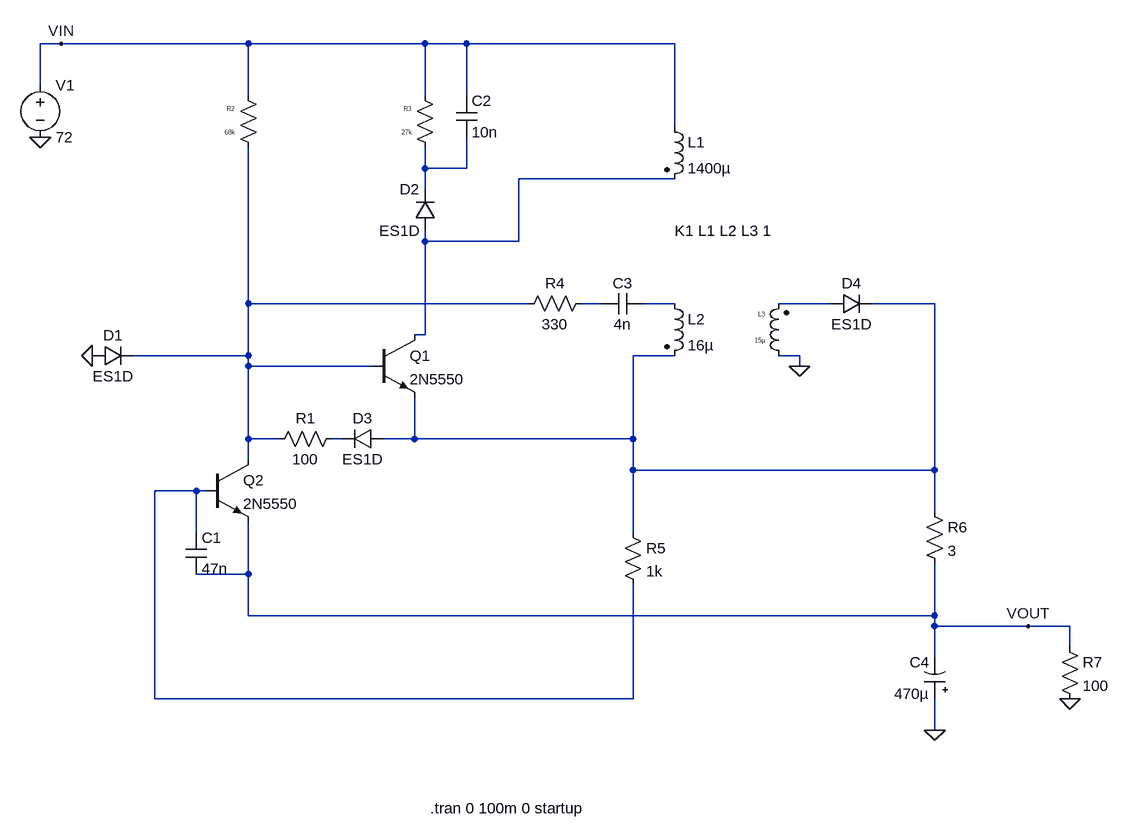
[diagram p0: schematic Motor Controller Power Supply.asc]
Motor Controller Power Supply.asc, the LTspice schematic file:
Version 4
SHEET 1 1496 968
WIRE -96 -224 -128 -224
WIRE 192 -224 -96 -224
WIRE 464 -224 192 -224
WIRE 528 -224 464 -224
WIRE 848 -224 528 -224
WIRE -128 -160 -128 -224
WIRE 192 -144 192 -224
WIRE 464 -144 464 -224
WIRE 528 -144 528 -224
WIRE 848 -96 848 -224
WIRE 464 -32 464 -64
WIRE 528 -32 528 -80
WIRE 528 -32 464 -32
WIRE 848 -16 608 -16
WIRE 464 0 464 -32
WIRE 464 80 464 64
WIRE 608 80 608 -16
WIRE 608 80 464 80
WIRE 192 176 192 -64
WIRE 624 176 192 176
WIRE 736 176 704 176
WIRE 848 176 800 176
WIRE 1088 176 1008 176
WIRE 1248 176 1152 176
WIRE 464 224 464 80
WIRE 464 224 448 224
WIRE 192 256 192 176
WIRE 192 256 16 256
WIRE 848 256 784 256
WIRE 1040 256 1008 256
WIRE 192 272 192 256
WIRE 384 272 192 272
WIRE 1040 272 1040 256
WIRE 192 384 192 272
WIRE 240 384 192 384
WIRE 336 384 320 384
WIRE 448 384 448 320
WIRE 448 384 400 384
WIRE 784 384 784 256
WIRE 784 384 448 384
WIRE 192 416 192 384
WIRE 784 432 784 384
WIRE 1248 432 1248 176
WIRE 1248 432 784 432
WIRE 112 464 48 464
WIRE 128 464 112 464
WIRE 1248 496 1248 432
WIRE 112 528 112 464
WIRE 784 528 784 432
WIRE 192 592 192 512
WIRE 192 592 112 592
WIRE 192 656 192 592
WIRE 1248 656 1248 576
WIRE 1248 656 192 656
WIRE 1248 672 1248 656
WIRE 1392 672 1248 672
WIRE 1456 672 1392 672
WIRE 1456 704 1456 672
WIRE 1248 720 1248 672
WIRE 48 784 48 464
WIRE 784 784 784 608
WIRE 784 784 48 784
WIRE 1248 832 1248 784
FLAG 1040 272 0
FLAG 1248 832 0
FLAG -96 -224 VIN
FLAG -48 256 0
FLAG -128 -80 0
FLAG 1456 784 0
FLAG 1392 672 VOUT
SYMBOL npn 384 224 R0
SYMATTR InstName Q1
SYMATTR Value 2N5550
SYMBOL npn 128 416 R0
SYMATTR InstName Q2
SYMATTR Value 2N5550
SYMBOL res 336 368 R90
WINDOW 0 0 56 VBottom 2
WINDOW 3 32 56 VTop 2
SYMATTR InstName R1
SYMATTR Value 100
SYMBOL res 208 -48 R180
WINDOW 0 36 76 Left 0
WINDOW 3 36 40 Left 0
SYMATTR InstName R2
SYMATTR Value 68k
SYMBOL res 480 -48 R180
WINDOW 0 36 76 Left 0
WINDOW 3 36 40 Left 0
SYMATTR InstName R3
SYMATTR Value 27k
SYMBOL res 608 192 R270
WINDOW 0 32 56 VTop 2
WINDOW 3 0 56 VBottom 2
SYMATTR InstName R4
SYMATTR Value 330
SYMBOL res 768 512 R0
SYMATTR InstName R5
SYMATTR Value 1k
SYMBOL res 1232 480 R0
SYMATTR InstName R6
SYMATTR Value 3
SYMBOL cap 96 528 R0
SYMATTR InstName C1
SYMATTR Value 47n
SYMBOL cap 512 -144 R0
SYMATTR InstName C2
SYMATTR Value 10n
SYMBOL cap 800 160 R90
WINDOW 0 0 32 VBottom 2
WINDOW 3 32 32 VTop 2
SYMATTR InstName C3
SYMATTR Value 4n
SYMBOL polcap 1264 784 R180
WINDOW 0 24 56 Left 2
WINDOW 3 24 8 Left 2
SYMATTR InstName C4
SYMATTR Value 470µ
SYMATTR Description Capacitor
SYMATTR Type cap
SYMATTR SpiceLine Rser=76m Lser=0 mfg="Nichicon" pn="UPR2A471MRH" type="Al electrolytic"
SYMBOL diode -48 272 R270
WINDOW 0 32 32 VTop 2
WINDOW 3 0 32 VBottom 2
SYMATTR InstName D1
SYMATTR Value ES1D
SYMBOL diode 480 64 R180
WINDOW 0 24 64 Left 2
WINDOW 3 24 0 Left 2
SYMATTR InstName D2
SYMATTR Value ES1D
SYMBOL diode 400 368 R90
WINDOW 0 0 32 VBottom 2
WINDOW 3 32 32 VTop 2
SYMATTR InstName D3
SYMATTR Value ES1D
SYMBOL diode 1088 192 R270
WINDOW 0 32 32 VTop 2
WINDOW 3 0 32 VBottom 2
SYMATTR InstName D4
SYMATTR Value ES1D
SYMBOL ind2 832 -112 R0
SYMATTR InstName L1
SYMATTR Value 1400µ
SYMATTR Type ind
SYMBOL ind2 832 160 R0
SYMATTR InstName L2
SYMATTR Value 16µ
SYMATTR Type ind
SYMBOL ind2 1024 272 R180
WINDOW 0 36 80 Left 0
WINDOW 3 36 40 Left 0
SYMATTR InstName L3
SYMATTR Value 15µ
SYMATTR Type ind
SYMBOL voltage -128 -176 R0
SYMATTR InstName V1
SYMATTR Value 72
SYMBOL res 1440 688 R0
SYMATTR InstName R7
SYMATTR Value 100
TEXT 848 64 Left 2 !K1 L1 L2 L3 1
TEXT 472 952 Left 2 !.tran 0 100m 0 startup

The netlist it stands for:
* Motor Controller Power Supply.asc
Q1 N002 N003 N007 0 2N5550
Q2 N003 N009 VOUT 0 2N5550
R1 N008 N003 100
R2 N003 VIN 68k
R3 N001 VIN 27k
R4 N003 N004 330
R5 N007 N009 1k
R6 N007 VOUT 3
C1 N009 VOUT 47n
C2 VIN N001 10n
C3 N005 N004 4n
C4 0 VOUT 470µ Rser=76m Lser=0 mfg="Nichicon" pn="UPR2A471MRH" type="Al electrolytic"
D1 0 N003 ES1D
D2 N002 N001 ES1D
D3 N007 N008 ES1D
D4 N006 N007 ES1D
L1 VIN N002 1400µ
L2 N005 N007 16µ
L3 0 N006 15µ
V1 VIN 0 72
R7 VOUT 0 100
.model D D
.lib standard.dio
.model NPN NPN
.model PNP PNP
.lib standard.bjt
K1 L1 L2 L3 1
.tran 0 100m 0 startup
.backanno
.end